# EAGLE schematic Mickoflus (EAGLE 7.7.0)
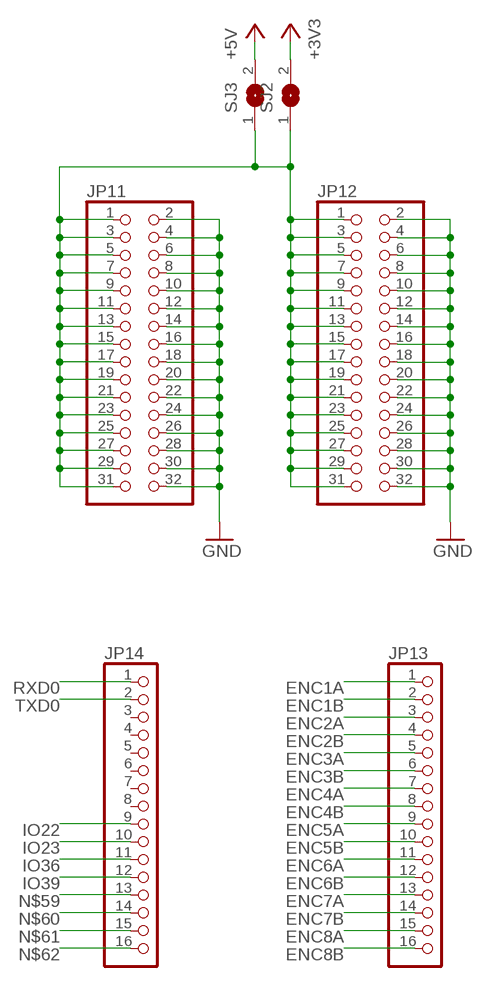
[diagram p0: schematic, sheet 1, part 1 of 2]
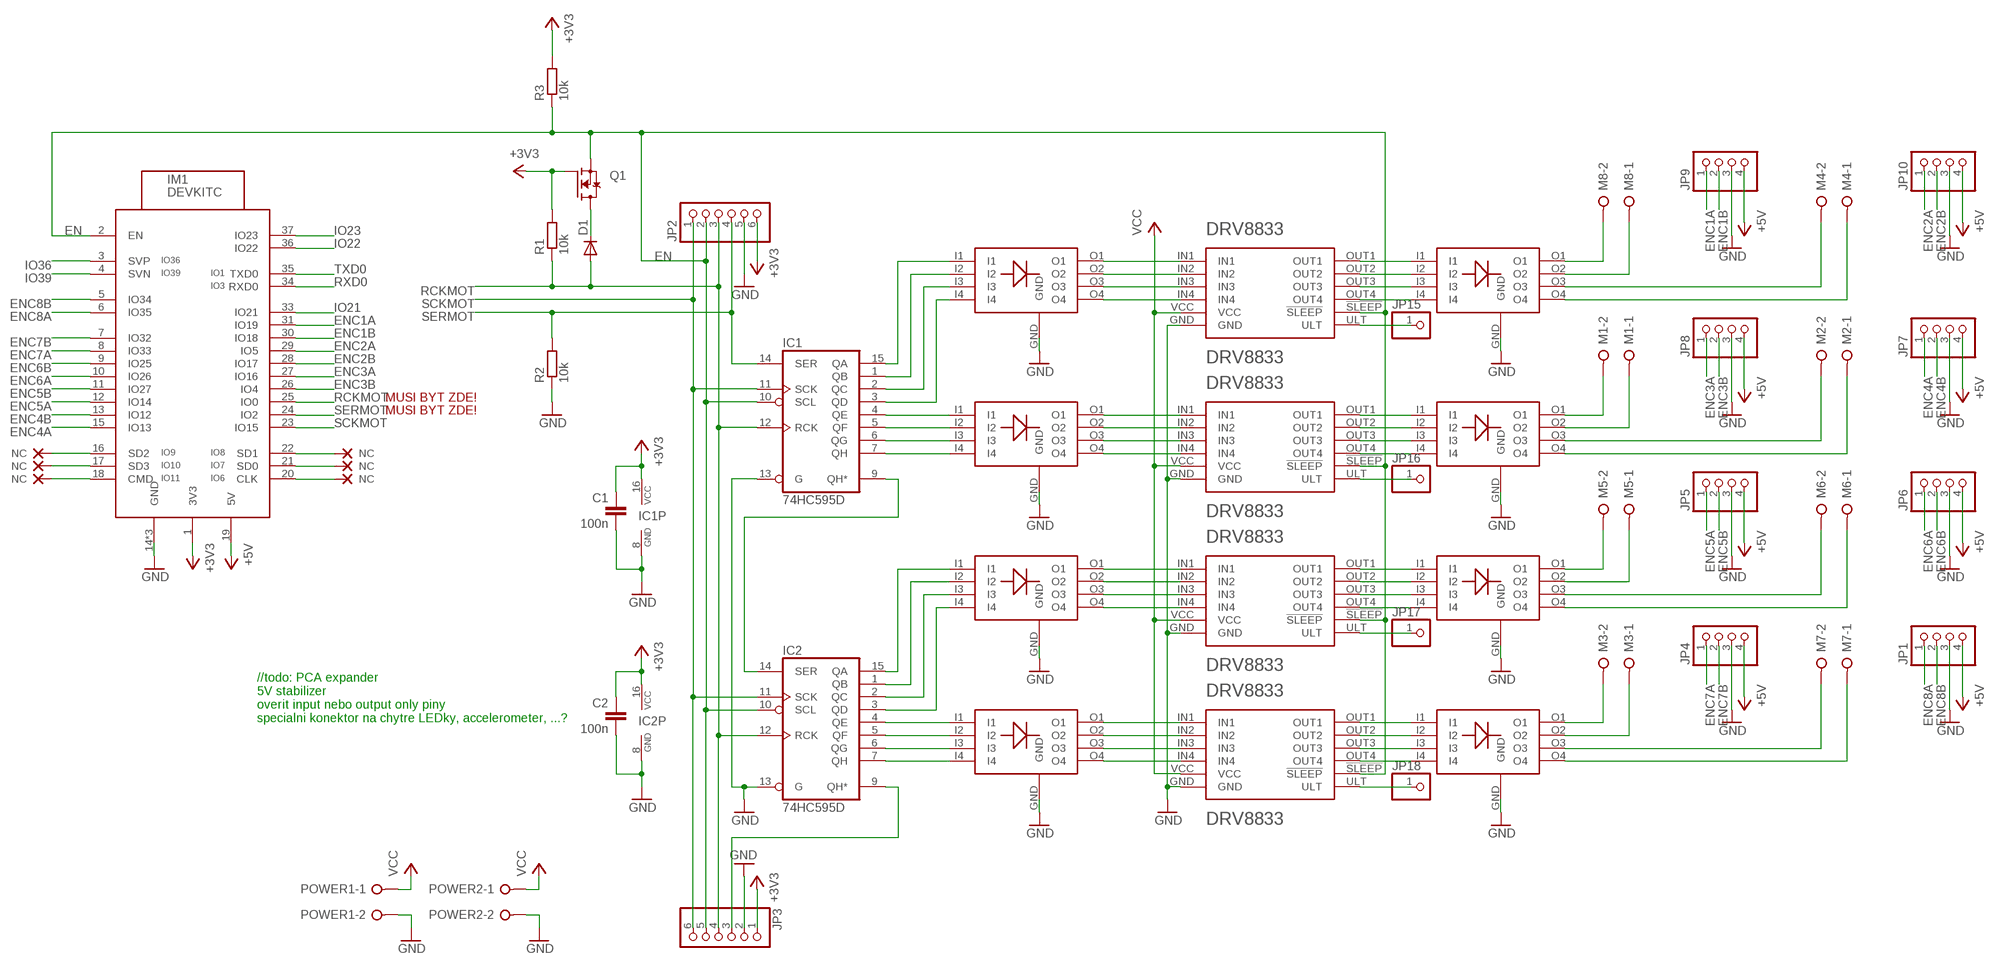
[diagram p1: schematic, sheet 1, part 2 of 2]

## Parts
C1  100n  C-EUC1206  [C1206]
C2  100n  C-EUC1206  [C1206]
D1  DIODE-0805  [D0805]
IC1  74HC595D  [SO16]
IC2  74HC595D  [SO16]
IM1  DEVKITC  [DEVKITC]
JP1  PINHD-1X4  [1X04]
JP2  PINHD-1X6  [1X06]
JP3  PINHD-1X6  [1X06]
JP4  PINHD-1X4  [1X04]
JP5  PINHD-1X4  [1X04]
JP6  PINHD-1X4  [1X04]
JP7  PINHD-1X4  [1X04]
JP8  PINHD-1X4  [1X04]
JP9  PINHD-1X4  [1X04]
JP10  PINHD-1X4  [1X04]
JP11  PINHD-2X16  [2X16]
JP12  PINHD-2X16  [2X16]
JP13  PINHD-1X16  [1X16]
JP14  PINHD-1X16  [1X16]
JP15  PINHD-1X1  [1X01]
JP16  PINHD-1X1  [1X01]
JP17  PINHD-1X1  [1X01]
JP18  PINHD-1X1  [1X01]
M1  W237-02P  [W237-132]
M2  W237-02P  [W237-132]
M3  W237-02P  [W237-132]
M4  W237-02P  [W237-132]
M5  W237-02P  [W237-132]
M6  W237-02P  [W237-132]
M7  W237-02P  [W237-132]
M8  W237-02P  [W237-132]
NC5  NC  (no package)
NC6  NC  (no package)
NC7  NC  (no package)
NC9  NC  (no package)
NC10  NC  (no package)
NC11  NC  (no package)
POWER1  W237-02P  [W237-132]
POWER2  W237-02P  [W237-132]
Q1  N-MOSFET-SOT23-GSD  [SOT23]
R1  10k  R-EU_R1206  [R1206]
R2  10k  R-EU_R1206  [R1206]
R3  10k  R-EU_R1206  [R1206]
SJ2  SJ  [SJ]
SJ3  SJ  [SJ]
U$1  DRV8833_BOARD  [PINHEAD]
U$2  DRV8833_BOARD  [PINHEAD]
U$3  DRV8833_BOARD  [PINHEAD]
U$4  DRV8833_BOARD  [PINHEAD]
U$5  4LED  [LED4_1206]
U$6  4LED  [LED4_1206]
U$7  4LED  [LED4_1206]
U$8  4LED  [LED4_1206]
U$9  4LED  [LED4_1206]
U$10  4LED  [LED4_1206]
U$11  4LED  [LED4_1206]
U$12  4LED  [LED4_1206]

## Nets
!FAULT0: JP15.1 U$1.ULT
!FAULT1: JP16.1 U$2.ULT
!FAULT2: JP17.1 U$3.ULT
!FAULT3: JP18.1 U$4.ULT
+3V3: C1.1 C2.1 IC1.16(VCC) IC2.16(VCC) IM1.1(3V3) JP2.6 JP3.1 Q1.1(G) R1.2 R3.2 SJ2.2
+5V: IM1.19(5V) JP1.4 JP4.4 JP5.4 JP6.4 JP7.4 JP8.4 JP9.4 JP10.4 SJ3.2
_EN_: D1.C Q1.3(D)
EN: IC1.10(SCL) IC2.10(SCL) IM1.2(EN) JP2.2 JP3.5 Q1.2(S) R3.1 U$1.!SLEEP U$2.!SLEEP U$3.!SLEEP U$4.!SLEEP
ENC1A: IM1.31(IO19) JP9.1 JP13.1
ENC1B: IM1.30(IO18) JP9.2 JP13.2
ENC2A: IM1.29(IO5) JP10.1 JP13.3
ENC2B: IM1.28(IO17) JP10.2 JP13.4
ENC3A: IM1.27(IO16) JP8.1 JP13.5
ENC3B: IM1.26(IO4) JP8.2 JP13.6
ENC4A: IM1.15(IO13) JP7.1 JP13.7
ENC4B: IM1.13(IO12) JP7.2 JP13.8
ENC5A: IM1.12(IO14) JP5.1 JP13.9
ENC5B: IM1.11(IO27) JP5.2 JP13.10
ENC6A: IM1.10(IO26) JP6.1 JP13.11
ENC6B: IM1.9(IO25) JP6.2 JP13.12
ENC7A: IM1.8(IO33) JP4.1 JP13.13
ENC7B: IM1.7(IO32) JP4.2 JP13.14
ENC8A: IM1.6(IO35) JP1.1 JP13.15
ENC8B: IM1.5(IO34) JP1.2 JP13.16
GND: C1.2 C2.2 IC1.8(GND) IC1.13(G) IC2.8(GND) IC2.13(G) IM1.14(GND) IM1.32(GND) IM1.38(GND) JP1.3 JP2.5 JP3.2 JP4.3 JP5.3 JP6.3 JP7.3 JP8.3 JP9.3 JP10.3 JP11.2 JP11.4 JP11.6 JP11.8 JP11.10 JP11.12 JP11.14 JP11.16 JP11.18 JP11.20 JP11.22 JP11.24 JP11.26 JP11.28 JP11.30 JP11.32 JP12.2 JP12.4 JP12.6 JP12.8 JP12.10 JP12.12 JP12.14 JP12.16 JP12.18 JP12.20 JP12.22 JP12.24 JP12.26 JP12.28 JP12.30 JP12.32 POWER1.2 POWER2.2 R2.1 U$1.GND U$2.GND U$3.GND U$4.GND U$5.GND U$6.GND U$7.GND U$8.GND U$9.GND U$10.GND U$11.GND U$12.GND
IO6_NC: IM1.20(CLK) NC9.NC
IO7_NC: IM1.21(SD0) NC10.NC
IO8_NC: IM1.22(SD1) NC11.NC
IO9_NC: IM1.16(SD2) NC5.NC
IO10_NC: IM1.17(SD3) NC6.NC
IO11_NC: IM1.18(CMD) NC7.NC
IO21: IM1.33(IO21)
IO22: IM1.36(IO22) JP14.9
IO23: IM1.37(IO23) JP14.10
IO36: IM1.3(SVP) JP14.11
IO39: IM1.4(SVN) JP14.12
N$1: IC1.9(QH*) IC2.14(SER)
N$2: M8.2 U$9.O1
N$3: IC2.9(QH*) JP3.3
N$4: JP11.1 JP11.3 JP11.5 JP11.7 JP11.9 JP11.11 JP11.13 JP11.15 JP11.17 JP11.19 JP11.21 JP11.23 JP11.25 JP11.27 JP11.29 JP11.31 JP12.1 JP12.3 JP12.5 JP12.7 JP12.9 JP12.11 JP12.13 JP12.15 JP12.17 JP12.19 JP12.21 JP12.23 JP12.25 JP12.27 JP12.29 JP12.31 SJ2.1 SJ3.1
N$7: U$1.IN1 U$5.O1
N$8: U$1.IN2 U$5.O2
N$9: U$1.IN3 U$5.O3
N$10: U$1.IN4 U$5.O4
N$11: IC1.15(QA) U$5.I1
N$12: IC1.1(QB) U$5.I2
N$13: IC1.2(QC) U$5.I3
N$14: IC1.3(QD) U$5.I4
N$15: M8.1 U$9.O2
N$17: IC1.4(QE) U$6.I1
N$18: IC1.5(QF) U$6.I2
N$19: IC1.6(QG) U$6.I3
N$20: IC1.7(QH) U$6.I4
N$21: IC2.15(QA) U$7.I1
N$22: IC2.1(QB) U$7.I2
N$23: IC2.2(QC) U$7.I3
N$24: IC2.3(QD) U$7.I4
N$27: M4.2 U$9.O3
N$28: M4.1 U$9.O4
N$29: M1.2 U$10.O1
N$30: M1.1 U$10.O2
N$31: M2.2 U$10.O3
N$32: M2.1 U$10.O4
N$33: M5.2 U$11.O1
N$34: M5.1 U$11.O2
N$35: M6.2 U$11.O3
N$36: M6.1 U$11.O4
N$37: M3.2 U$12.O1
N$38: M3.1 U$12.O2
N$39: M7.2 U$12.O3
N$40: M7.1 U$12.O4
N$59: JP14.13
N$60: JP14.14
N$61: JP14.15
N$62: JP14.16
N$72: U$2.IN1 U$6.O1
N$73: U$2.IN2 U$6.O2
N$74: U$2.IN3 U$6.O3
N$75: U$2.IN4 U$6.O4
N$76: U$3.IN1 U$7.O1
N$77: U$3.IN2 U$7.O2
N$78: U$3.IN3 U$7.O3
N$79: U$3.IN4 U$7.O4
N$80: IC2.4(QE) U$8.I1
N$81: IC2.5(QF) U$8.I2
N$82: IC2.6(QG) U$8.I3
N$83: IC2.7(QH) U$8.I4
N$84: U$4.IN1 U$8.O1
N$85: U$4.IN2 U$8.O2
N$86: U$4.IN3 U$8.O3
N$87: U$4.IN4 U$8.O4
N$88: U$4.OUT4 U$12.I4
N$89: U$4.OUT3 U$12.I3
N$90: U$4.OUT2 U$12.I2
N$91: U$4.OUT1 U$12.I1
N$92: U$3.OUT4 U$11.I4
N$93: U$3.OUT3 U$11.I3
N$94: U$3.OUT2 U$11.I2
N$95: U$3.OUT1 U$11.I1
N$96: U$2.OUT4 U$10.I4
N$97: U$2.OUT3 U$10.I3
N$98: U$2.OUT2 U$10.I2
N$99: U$2.OUT1 U$10.I1
N$100: U$1.OUT4 U$9.I4
N$101: U$1.OUT3 U$9.I3
N$102: U$1.OUT2 U$9.I2
N$103: U$1.OUT1 U$9.I1
RCKMOT: D1.A IC1.12(RCK) IC2.12(RCK) IM1.25(IO0) JP2.3 JP3.4 R1.1
RXD0: IM1.34(RXD0) JP14.1
SCKMOT: IC1.11(SCK) IC2.11(SCK) IM1.23(IO15) JP2.1 JP3.6
SERMOT: IC1.14(SER) IM1.24(IO2) JP2.4 R2.2
TXD0: IM1.35(TXD0) JP14.2
VCC: POWER1.1 POWER2.1 U$1.VCC U$2.VCC U$3.VCC U$4.VCC
Unconnected: JP14.3 JP14.4 JP14.5 JP14.6 JP14.7 JP14.8

## Notes on the sheet
- MUSI BYT ZDE!
- MUSI BYT ZDE!
- //todo: PCA expander
  5V stabilizer
  overit input nebo output only piny
  specialni konektor na chytre LEDky, accelerometer, ...?

## Library data of the parts
C1 C2 = rcl_upravena:C-EU: CAPACITOR, European symbol
D1 = diode:DIODE: DIODE ultra fast-recovery rectifier
IC1 IC2 = 74xx-eu:74*595: 8-bit SHIFT REGISTER, output latch
IM1 = esp32:DEVKITC
JP1 JP4-JP10 = pinhead:PINHD-1X4: PIN HEADER
JP2 JP3 = pinhead:PINHD-1X6: PIN HEADER
JP11 JP12 = pinhead:PINHD-2X16: PIN HEADER
JP13 JP14 = pinhead:PINHD-1X16: PIN HEADER
JP15-JP18 = pinhead:PINHD-1X1: PIN HEADER
M1-M8 POWER1 POWER2 = con-wago-508:W237-02P: WAGO SREW CLAMP; OC_FARNELL: unknown; OC_NEWARK: unknown
NC5-NC7 NC9-NC11 = NC:NC: _EXTERNAL_
Q1 = transistors:N-MOSFET
R1-R3 = rcl_upravena:R-EU_: RESISTOR, European symbol
SJ2 SJ3 = jumper:SJ: SMD solder JUMPER
U$1-U$4 = DRV8833board:DRV8833_BOARD
U$5-U$12 = 4LED:4LED